# Altium schematic sheet Power.SchDoc
size A4
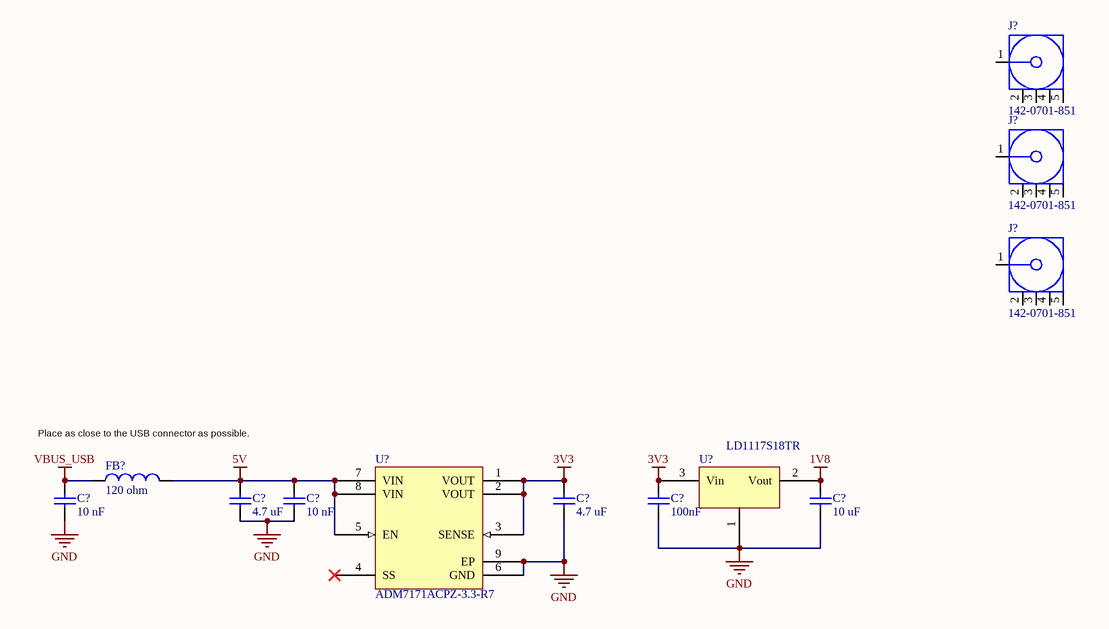
[diagram p0: Power.SchDoc]

## Parts
(Parts that share a designator on the sheet are numbered #1, #2 ... from top to bottom, then left to right.)
C?#1  10 nF  [Chip2PinSM127P600-8N_CAP0402]
C?#2  4.7 uF  [CAPC1608X10L]
C?#3  10 nF  [Chip2PinSM127P600-8N_CAP0402]
C?#4  4.7 uF  [CAPC1608X10L]
C?#5  100nF  [0603 Cap]
C?#6  10 uF  [CAPC1608X10L]
FB?  120 ohm  [INDC1608X08L]
J?#1  142-0701-851  [142-0701-851]
J?#2  142-0701-851  [142-0701-851]
J?#3  142-0701-851  [142-0701-851]
U?#1  LD1117S18TR  [SOT223-123]
U?#2  ADM7171ACPZ-3.3-R7  [SON50P300X80_HS-9N LFCSP_WD Analog]

## Nets
1V8: C?#6.2 U?#1.2(Vout)
3V3: C?#4.2 C?#5.2 U?#1.3(Vin) U?#2.1(VOUT) U?#2.2(VOUT) U?#2.3(SENSE)
5V: C?#2.2 C?#3.2 FB?.2 U?#2.5(EN) U?#2.7(VIN) U?#2.8(VIN)
GND: C?#1.1 C?#2.1 C?#3.1 C?#4.1 C?#5.1 C?#6.1 U?#1.1(GND) U?#2.6(GND) U?#2.9(EP)
VBUS_USB: C?#1.2 FB?.1

Not connected (* = marked no-connect by the designer): J?#1 1(Signal) 2(GND) 3(GND) 4(GND) 5(GND); J?#2 1(Signal) 2(GND) 3(GND) 4(GND) 5(GND); J?#3 1(Signal) 2(GND) 3(GND) 4(GND) 5(GND); U?#2 4(SS)*

## Notes on the sheet
- Place as close to the USB connector as possible.

## Library data of the parts
C?#1 C?#3 = CL05B103KA5NNNC: CAP CER 10000PF 25V X7R 0402; Manufacturer: Samsung Electro-Mechanics America, Inc.; Tolerance: ±10%; Supplier 1: Digi-Key; Manufacturer Part Number: CL05B103KA5NNNC; RoHS: RoHS Compliant; Category: Capacitors; Stock 1: 615673; Pricing 1: 1=0.09, 10=0.009, 25=0.006, 50=0.0044, 100=0.0037, 250=0.00308, 500=0.00266, 1000=0.00208, 5000=0.00174 (EUR); Packaging: Cut Tape (CT); Part Status: Active; Capacitance: 10000pF; Voltage - Rated: 25V; Temperature Coefficient: X7R; Operating Temperature: -55°C ~ 125°C; Features: -; Ratings: -; Applications: General Purpose; Mounting Type: Surface Mount, MLCC; Package / Case: 0402 (1005 Metric); Size / Dimension: 0.039" L x 0.020" W (1.00mm x 0.50mm); Height - Seated (Max): -; Thickness (Max): 0.022" (0.55mm); Lead Spacing: -; Lead Style: -; ComponentLink1URL: http://www.samsungsem.com/kr/support/product-search/mlcc/__icsFiles/afieldfile/2016/08/18/S_CL05B103KA5NNNC.pdf; ComponentLink1Description: http://www.samsungsem.com/kr/support/product-search/mlcc/__icsFiles/afieldfile/2016/08/18/S_CL05B103KA5NNNC.pdf; Supplier Part Number 1: 1276-1057-1-ND
C?#2 C?#4 = GRM188R61C475KAAJD: Multilayer Ceramic Capacitors MLCC - SMD/SMT 0603 4.7uF 16volts X5R + - 10%; Manufacturer: Murata Electronics; Type: General Purpose MLCC; Voltage Rating DC: 16 V; Product Status: New Product; Voltage - Rated: 16V; Supplier 1: Mouser; Manufacturer Part Number: GRM188R61C475KAAJD; RoHS: RoHS Compliant; Category: Multilayer Ceramic Capacitors MLCC - SMD/SMT; Stock 1: 10870; Pricing 1: 1=0.262, 10=0.110, 100=0.066, 1000=0.056, 4000=0.042, 8000=0.040, 24000=0.037, 48000=0.035, 100000=0.030 (EUR); Capacitance: 4.7 uF; Height: 0.8 mm; Length: 1.6 mm; Package/Case: 0603 (1608 metric); Packaging: Reel; Product: General Type MLCCs; Series: GRM; Termination Style: SMD/SMT; Tolerance: 10 %; Width: 0.8 mm; Brand: Murata Electronics; Case Code - in: 0603; Case Code - mm: 1608; Dielectric: X5R; Maximum Operating Temperature: + 85 C; Minimum Operating Temperature: - 55 C; RoHS - Mouser: Y; Minimum Order Quantity: 1; Reeling: True; ComponentLink1URL: http://www.mouser.com/ds/2/281/c02e-2905.pdf; ComponentLink1Description: http://www.mouser.com/ds/2/281/c02e-2905.pdf; Supplier 2: Digi-Key; Stock 2: 0; Pricing 2: 1=0.27, 10=0.224, 25=0.154, 50=0.1262, 100=0.112, 250=0.08404, 500=0.07424, 1000=0.06582 (EUR); Temperature Coefficient: X5R; Mounting Type: Surface Mount, MLCC; Operating Temperature: -55°C ~ 85°C; Applications: General Purpose; Ratings: -; Package / Case: 0603 (1608 Metric); Size / Dimension: 0.063" L x 0.031" W (1.60mm x 0.80mm); Height - Seated (Max): -; Thickness (Max): 0.037" (0.95mm); Lead Spacing: -; Features: -; Lead Style: -; ComponentLink2URL: http://www.murata.com/~/media/webrenewal/support/library/catalog/products/capacitor/mlcc/c02e.ashx; ComponentLink2Description: http://www.murata.com/~/media/webrenewal/support/library/catalog/products/capacitor/mlcc/c02e.ashx; Supplier Part Number 1: 81-GRM188R61C475KAJD; Supplier Part Number 2: 490-10481-1-ND
C?#5 = C0603C104K4RACTU: CAP CER 0.1UF 16V X7R 0603; Manufacturer: KEMET; Capacitance: 0.1µF; Tolerance: ±10%; Supplier 1: Digi-Key; Manufacturer Part Number: C0603C104K4RACTU; RoHS: RoHS Compliant; Category: Capacitors; Stock 1: 4491346; Pricing 1: 1=0.09, 10=0.022, 25=0.016, 50=0.0122, 100=0.01, 250=0.00836, 500=0.0071, 1000=0.00559 (EUR); Packaging: Digi-Reel®; Part Status: Active; Voltage - Rated: 16V; Temperature Coefficient: X7R; Operating Temperature: -55°C ~ 125°C; Features: -; Ratings: -; Applications: General Purpose; Failure Rate: -; Mounting Type: Surface Mount, MLCC; Package / Case: 0603 (1608 Metric); Size / Dimension: 0.063" L x 0.031" W (1.60mm x 0.80mm); Height - Seated (Max): -; Thickness (Max): 0.034" (0.87mm); Lead Spacing: -; Lead Style: -; ComponentLink1URL: http://www.kemet.com/docfinder?Partnumber=C0603C104K4RACTU; ComponentLink1Description: http://www.kemet.com/docfinder?Partnumber=C0603C104K4RACTU; Supplier Part Number 1: 399-1096-6-ND
C?#6 = C1608X5R1A106K080AC: Multilayer Ceramic Capacitors MLCC - SMD/SMT 10uF 10% 10Volts; Manufacturer: TDK; Type: Multilayer Ceramic Chip Capacitor; Voltage Rating DC: 10 V; Case Height: 0.8 mm; Case Length: 1.6 mm; Dielectric: X5R; Temperature Coefficient/Code: +/- 15 %; Voltage - Rated: 10V; Supplier 1: Mouser; Supplier Part Number 1: 810-C1608X5R1A106K; Manufacturer Part Number: C1608X5R1A106K080AC; RoHS: RoHS Compliant; Category: Multilayer Ceramic Capacitors MLCC - SMD/SMT; Stock 1: 295613; Pricing 1: 1=0.407, 10=0.221, 100=0.132, 1000=0.119, 4000=0.087, 8000=0.080, 24000=0.078, 48000=0.073, 100000=0.067 (EUR); Capacitance: 10 uF; Operating Temperature Range: - 55 C to + 85 C; Package/Case: 0603 (1608 metric); Packaging: Reel; Product: General Type MLCCs; Termination Style: SMD/SMT; Tolerance: 10 %; Brand: TDK; Case Code - in: 0603; Case Code - mm: 1608; Case Width: 0.8 mm; Maximum Operating Temperature: + 85 C; Minimum Operating Temperature: - 55 C; Standard Pack Qty: 4000; RoHS - Mouser: Y; Minimum Order Quantity: 1; Reeling: True; ComponentLink1URL: http://product.tdk.com/capacitor/mlcc/detailed_information.php?lang=en&ref=jp&part_no=C1608X5R1A106K080AC; ComponentLink1Description: http://product.tdk.com/capacitor/mlcc/detailed_information.php?lang=en&ref=jp&part_no=C1608X5R1A106K080AC; Supplier 2: Digi-Key; Supplier Part Number 2: 445-7486-1-ND; Stock 2: 583145; Pricing 2: 1=0.42, 10=0.37, 100=0.1848, 250=0.14784, 500=0.13462, 1000=0.12142 (EUR); Temperature Coefficient: X5R; Mounting Type: Surface Mount, MLCC; Operating Temperature: -55°C ~ 85°C; Applications: General Purpose; Ratings: -; Package / Case: 0603 (1608 Metric); Size / Dimension: 0.063" L x 0.031" W (1.60mm x 0.80mm); Height - Seated (Max): -; Thickness (Max): 0.035" (0.90mm); Lead Spacing: -; Features: -; Lead Style: -; ComponentLink2URL: http://product.tdk.com/en/catalog/datasheets/mlcc_commercial_general_en.pdf; ComponentLink2Description: http://product.tdk.com/en/catalog/datasheets/mlcc_commercial_general_en.pdf
FB? = BLM18PG121SN1D: FERRITE BEAD 120 OHM 0603 1LN; Manufacturer: Murata Electronics North America; Filter Type: Power Line; Number of Lines: 1; Impedance @ Frequency: 120 Ohm @ 100MHz; Current Rating (Max): 2A; DC Resistance (DCR) (Max): 50 mOhm; Supplier 1: Digi-Key; Manufacturer Part Number: BLM18PG121SN1D; RoHS: RoHS Compliant; Category: Filters; Stock 1: 1305577; Pricing 1: 1=0.09, 10=0.067, 25=0.06, 50=0.0438, 100=0.038, 250=0.02996, 500=0.0253, 1000=0.02132 (EUR); Packaging: Cut Tape (CT); Part Status: Active; Ratings: -; Operating Temperature: -55°C ~ 125°C; Package / Case: 0603 (1608 Metric); Mounting Type: Surface Mount; Height (Max): 0.037" (0.95mm); Size / Dimension: 0.063" L x 0.031" W (1.60mm x 0.80mm); ComponentLink1URL: http://www.murata.com/en-us/products/productdata/8796738650142/ENFA0003.pdf; ComponentLink1Description: http://www.murata.com/en-us/products/productdata/8796738650142/ENFA0003.pdf; Supplier Part Number 1: 490-1037-1-ND
J?#1-J?#3 = 142-0701-851: RF Connectors / Coaxial Connectors PC END MT JCK GLD .062 BOARDS TAB; Manufacturer: Johnson / Cinch Connectivity Solutions; Body Material: Brass; Body Style: Straight; Gender: Jack (Female); Impedance: 50 Ohms; RF Series: SMA; Maximum Frequency: 18 GHz; Connector Type: Jack, Female Socket; Contact Termination: Solder; Frequency - Max: 18GHz; Body Finish: Gold; Center Contact Material: Beryllium Copper; Dielectric Material: Polytetrafluoroethylene (PTFE); Voltage Rating: 335V; Supplier 1: Mouser; Supplier Part Number 1: 530-142-0701-851; Manufacturer Part Number: 142-0701-851; RoHS: RoHS Compliant; Category: RF Connectors / Coaxial Connectors; Stock 1: 21985; Pricing 1: 1=4.65, 10=4.13, 25=3.56, 100=3.09, 500=2.49, 1000=2.34 (EUR); Contact Plating: Gold; Operating Temperature Range: - 65 C to + 165 C; Orientation: Straight; Product: Connectors; Series: SMA; Termination Style: Solder; Brand: Johnson / Cinch Connectivity Solutions; Product Category: SMA Connectors; Standard Pack Qty: 5; RoHS - Mouser: Y; Minimum Order Quantity: 1; Reeling: False; ComponentLink1URL: http://emersonconnectivity.com/OA_HTML/ibeCCtpItmDspRte.jsp?item=4253264; ComponentLink1Description: http://emersonconnectivity.com/OA_HTML/ibeCCtpItmDspRte.jsp?item=4253264; Supplier 2: Digi-Key; Supplier Part Number 2: J658-ND; Stock 2: 64832; Pricing 2: 1=5.23, 10=4.656, 50=3.8012, 100=3.421, 250=3.13592, 500=2.66078, 750=2.52775, 1000=2.3757, 2500=2.28068 (EUR); Packaging: Bulk; Connector Style: SMA; Shield Termination: Solder; Mounting Type: Board Edge, End Launch; Cable Group: -; Fastening Type: Threaded; Features: -; Housing Color: Gold; Ingress Protection: -; Center Contact Plating: Gold; Operating Temperature: -65°C ~ 165°C; ComponentLink2URL: http://emersonconnectivity.com/OA_MEDIA/drawings/dr-1420701851.pdf; ComponentLink2Description: http://emersonconnectivity.com/OA_MEDIA/drawings/dr-1420701851.pdf
U?#1 = LD1117S18TR: IC REG LDO 1.8V 0.8A SOT223; Manufacturer: STMicroelectronics; Output Configuration: Positive; Output Type: Fixed; Voltage - Input (Max): 15V; Voltage Dropout (Max): 1.2V @ 800mA; Current - Output: 800mA; Current - Supply: 10mA; PSRR: 75dB (120Hz); Protection Features: Over Current, Over Temperature; Supplier 1: Digi-Key; Manufacturer Part Number: LD1117S18TR; RoHS: RoHS Compliant; Category: Integrated Circuits (ICs); Stock 1: 2476; Pricing 1: 1=0.42, 10=0.357, 100=0.2669, 500=0.20966, 1000=0.162 (EUR); Packaging: Cut Tape (CT); Part Status: Active; Voltage - Output (Min/Fixed): 1.8V; Voltage - Output (Max): -; Control Features: -; Operating Temperature: 0°C ~ 125°C; Mounting Type: Surface Mount; Package / Case: TO-261-4, TO-261AA; Supplier Device Package: SOT-223; ComponentLink1URL: http://www.st.com/content/ccc/resource/technical/document/datasheet/99/3b/7d/91/91/51/4b/be/CD00000544.pdf/files/CD00000544.pdf/jcr:content/translations/en.CD00000544.pdf; ComponentLink1Description: http://www.st.com/content/ccc/resource/technical/document/datasheet/99/3b/7d/91/91/51/4b/be/CD00000544.pdf/files/CD00000544.pdf/jcr:content/translations/en.CD00000544.pdf; Supplier Part Number 1: 497-7308-1-ND
U?#2 = ADM7171ACPZ-3.3-R7: IC REG LDO 3.3V 1A 8-LFCSP; Manufacturer: Analog Devices Inc.; Regulator Topology: Positive Fixed; Voltage - Dropout (Typical): 0.084V @ 1A; Number of Regulators: 1; Voltage - Input: Up to 6.5V; Current - Limit (Min): 1.3A; Supplier 1: Digi-Key; Manufacturer Part Number: ADM7171ACPZ-3.3-R7; RoHS: RoHS Compliant; Category: Integrated Circuits (ICs); Stock 1: 1479; Pricing 1: 1=2.96, 10=2.655, 100=2.1757, 500=1.85208 (EUR); Packaging: Cut Tape (CT); Part Status: Active; Voltage - Output: 3.3V; Current - Output: 1A; Operating Temperature: -40°C ~ 125°C; Mounting Type: Surface Mount; Package / Case: 8-WFDFN Exposed Pad, CSP; Supplier Device Package: 8-LFCSP-WD (3x3); ComponentLink1URL: http://www.analog.com/media/en/technical-documentation/data-sheets/ADM7171.pdf; ComponentLink1Description: http://www.analog.com/media/en/technical-documentation/data-sheets/ADM7171.pdf; Supplier Part Number 1: ADM7171ACPZ-3.3-R7CT-ND; .SymbolChecked: *; .FootprintChecked: *; .Critical: *